# EAGLE board untitled (EAGLE 9.6.2)
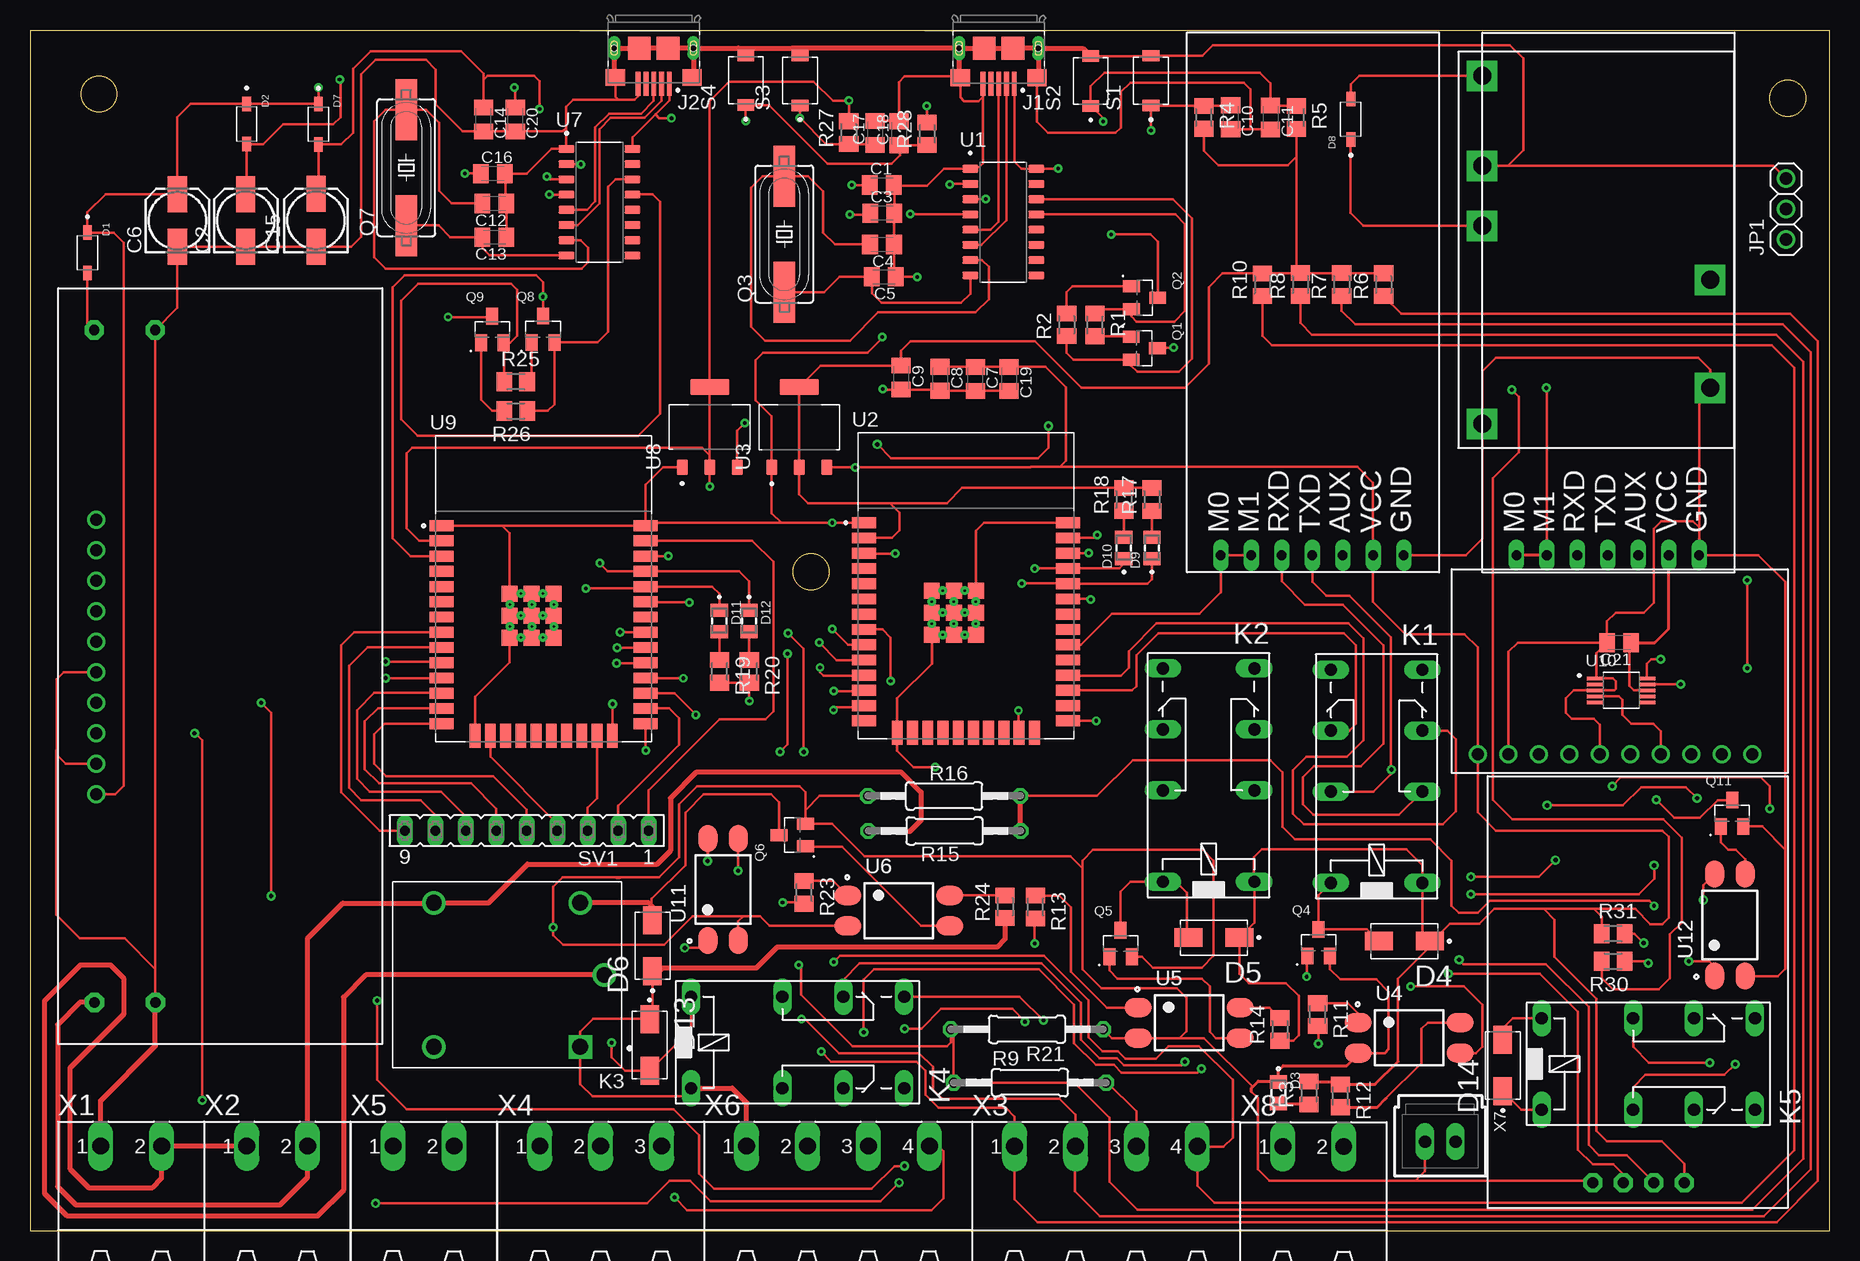
[diagram p1: board, top side]
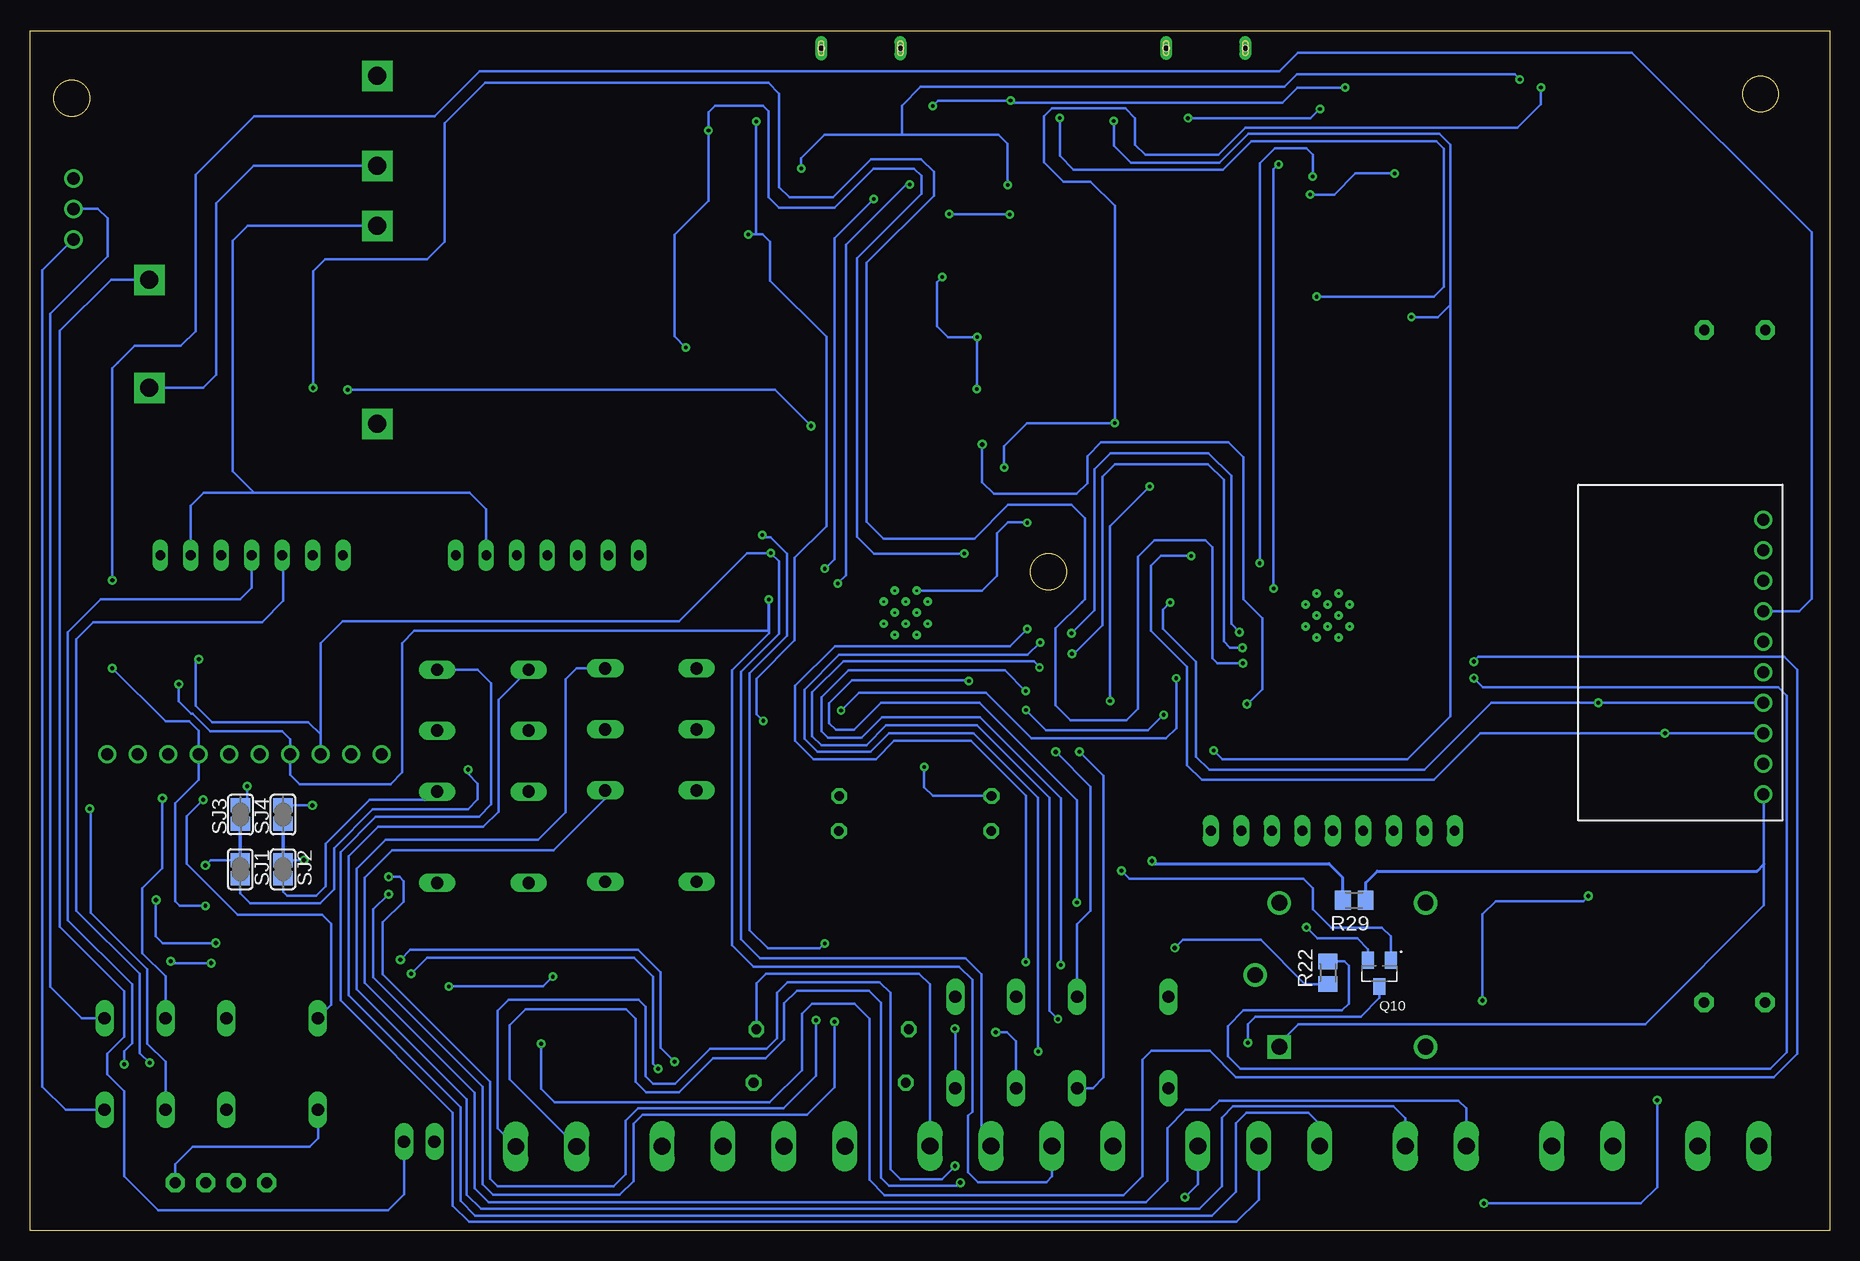
[diagram p2: board, bottom side, seen from below]

Size 150 x 100 mm. Coordinates in mm from the lower left corner, seen from the top.
Outline: 0,0 150,0 150,100 0,100 0,0
Outline: circle at 5.75,94.74 radius 1.5
Outline: circle at 146.5,94.38 radius 1.5
Outline: circle at 65.09,54.92 radius 1.5
Copper layers (1*16): Top 0.035mm / dielectric 1.5mm / Bottom 0.035mm
Design rules "default *": minimum track width 6mil, minimum drill 0.3mm, track to track 6mil, track to pad 6mil, pad to pad 6mil, via to via 6mil, smd to smd 6mil, copper to edge 40mil, drill to drill 40mil, minimum pad ring 10mil, minimum via ring 8mil, stop-mask expansion 4mil, vias tented up to drill 0mil, thermal gap 10mil

## Footprints (pad centres in the part's own frame; a part is rotated, then mirrored left to right if it is on the bottom)
ADS1115 = drill 1: A0 -6.35,-1.27; A1 -6.35,-3.81; A2 -6.35,-6.35; A3 -6.35,-8.89; ADDR -6.35,3.81; ALRT -6.35,1.27; GND -6.35,11.43; SCL -6.35,8.89; SDA -6.35,6.35; VDD -6.35,13.97
C0805K = smd 1.3 x 1.6: 1 -1,0; 2 1,0
153CLV-0505 = smd 3 x 1.6: + 2.2,0; - -2.2,0
SOD3715X145N = smd 1.21 x 0.73: A 1.68,0; C -1.68,0
LEDC2012X120N = smd 1.1 x 1.45: A 0.9,0; C -0.9,0
DIOM5226X240N = smd 2.33 x 1.55: A 2.135,0; C -2.135,0
EBYTEE220-900T22D = drill 0.8 pad 1.27 long: AUX -4.56,-10.98; GND -4.56,-16.06; M0 -4.56,-0.82; M1 -4.56,-3.36; RXD -4.56,-5.9; TXD -4.56,-8.44; VCC -4.56,-13.52
FCI_10118193-0001LF = smd 0.4 x 2: 1 -1.3,2.975; 2 -0.65,2.975; 3 0,2.975; 4 0.65,2.975; 5 1.3,2.975 | smd 1.6 x 1.4: S1 -3.2,2.45; S2 3.2,2.45 | smd 1.9 x 1.9: S3 1.2,0; S4 -1.2,0 | drill 0.5 pad 0.9 long: S5 -3.3,0; S6 3.3,0 | hole 0.5: -3.3,0; 3.3,0
1X03 = drill 1.016: 1 -2.54,0; 2 0,0; 3 2.54,0
351 = drill 1.016 long: 1 -3.81,-3.81; 16 -3.81,3.81; O1 8.89,-3.81; O2 8.89,3.81; P1 3.81,-3.81; P2 3.81,3.81; S1 13.97,-3.81; S2 13.97,3.81
RELAY_SRD-05VDC-SL-C = drill 1.32 square: A1 -6.1,6 | drill 1.32: A2 -6.1,-6; NC 6.1,6; NO 6.1,-6 | drill 1.29: COM -8.1,0
MODUL-BATT = drill 1.5 pad 2.54 square: BATT+ 14,2; BATT- 5,2; IN+ 18.5,21; IN- 2,21; OUT+ 31,21; OUT- 23.5,21
NEO-6MGPS = drill 0.9 pad 1.6 octagon: 5V -8.89,7.62; GND -8.89,15.24; RX -8.89,10.16; TX -8.89,12.7
SOT95P240X120-3N = smd 1 x 1.4: 1 -0.95,-1.1; 2 0.95,-1.1; 3 0,1.1
SM49 = smd 5.08 x 1.778: 1 -4.826,0; 2 4.826,0
M0805 = smd 1.3 x 1.6: 1 -0.95,0; 2 0.95,0
0207/12 = drill 0.813 octagon: 1 -6.35,0; 2 6.35,0
SW_TL1015AF160QG = smd 0.95 x 1.4: 1 -2.075,0; 2 2.075,0
SJ = smd 1.168 x 1.6: 1 -0.762,0; 2 0.762,0
SUPER-STEPDOWN = drill 0.85 pad 1.6 octagon: +5V 59.509,24.006; GND 59.509,18.926; IN+ 3.478,23.979; IN- 3.478,18.899
FE09 = drill 0.813 long: 1 -10.16,0; 2 -7.62,0; 3 -5.08,0; 4 -2.54,0; 5 0,0; 6 2.54,0; 7 5.08,0; 8 7.62,0; 9 10.16,0
SOIC127P600X180-16N = smd 1.31 x 0.62: 1 -2.75,4.445; 2 -2.75,3.175; 3 -2.75,1.905; 4 -2.75,0.635; 5 -2.75,-0.635; 6 -2.75,-1.905; 7 -2.75,-3.175; 8 -2.75,-4.445; 9 2.75,-4.445; 10 2.75,-3.175; 11 2.75,-1.905; 12 2.75,-0.635; 13 2.75,0.635; 14 2.75,1.905; 15 2.75,3.175; 16 2.75,4.445
MODULE_ESP32-WROOM-32D = smd 2 x 0.9: 1 -8.5,5.26; 2 -8.5,3.99; 3 -8.5,2.72; 4 -8.5,1.45; 5 -8.5,0.18; 6 -8.5,-1.09; 7 -8.5,-2.36; 8 -8.5,-3.63; 9 -8.5,-4.9; 10 -8.5,-6.17; 11 -8.5,-7.44; 12 -8.5,-8.71; 13 -8.5,-9.98; 14 -8.5,-11.25; 25 8.5,-11.25; 26 8.5,-9.98; 27 8.5,-8.71; 28 8.5,-7.44; 29 8.5,-6.17; 30 8.5,-4.9; 31 8.5,-3.63; 32 8.5,-2.36; 33 8.5,-1.09; 34 8.5,0.18; 35 8.5,1.45; 36 8.5,2.72; 37 8.5,3.99; 38 8.5,5.26 | smd 0.9 x 2: 15 -5.715,-12.25; 16 -4.445,-12.25; 17 -3.175,-12.25; 18 -1.905,-12.25; 19 -0.635,-12.25; 20 0.635,-12.25; 21 1.905,-12.25; 22 3.175,-12.25; 23 4.445,-12.25; 24 5.715,-12.25 | smd 1.33 x 1.33: 39_1 -2.835,-0.405; 39_2 -1,-0.405; 39_3 0.835,-0.405; 39_4 -2.835,-2.24; 39_5 -1,-2.24; 39_6 0.835,-2.24; 39_7 -2.835,-4.075; 39_8 -1,-4.075; 39_9 0.835,-4.075 | drill 0.2 pad 0.3: 39_10 -1.917,-0.405; 39_11 -0.083,-0.405; 39_12 -2.835,-1.323; 39_13 -1,-1.323; 39_14 0.835,-1.323; 39_15 -1.917,-2.24; 39_16 -0.083,-2.24; 39_17 -2.835,-3.158; 39_18 -1,-3.158; 39_19 0.835,-3.158; 39_20 -1.917,-4.075; 39_21 -0.083,-4.075
SOT229P700X180-4N = smd 1.31 x 0.93: 1 -3.345,2.29; 2 -3.345,0; 3 -3.345,-2.29 | smd 1.31 x 3.24: 4 3.345,0
SOT254P975X400-4N = smd 2.25 x 1.6: 1 -4.25,1.27; 2 -4.25,-1.27; 3 4.25,-1.27; 4 4.25,1.27
SOP50P490X110-10N = smd 1.47 x 0.28: 1 -2.15,1; 2 -2.15,0.5; 3 -2.15,0; 4 -2.15,-0.5; 5 -2.15,-1; 6 2.15,-1; 7 2.15,-0.5; 8 2.15,0; 9 2.15,0.5; 10 2.15,1
MSTBA2 = drill 1.397 long: 1 -2.54,5.08; 2 2.54,5.08
MSTBA4 = drill 1.397 long: 1 -7.62,5.08; 2 -2.54,5.08; 3 2.54,5.08; 4 7.62,5.08
MSTBA3 = drill 1.397 long: 1 -5.08,5.08; 2 0,5.08; 3 5.08,5.08
70543-02 = drill 1.016 long: 1 -1.27,0; 2 1.27,0

## Placement (x,y rotation side)
ADS1  [ADS1115]  134.66,46.07 90 top
ADS2  [ADS1115]  11.86,50.36 180 bottom
C1  1uF  [C0805K]  71.01,87.16 0 top
C2  10uF/16V  [153CLV-0505]  17.98,84.2 90 top
C3  100nF  [C0805K]  71.05,84.81 0 top
C4  22pF  [C0805K]  71.02,82.2 180 top
C5  22pF  [C0805K]  71.17,79.51 180 top
C6  10uF/16V  [153CLV-0505]  12.29,84.19 90 top
C7  1uF  [C0805K]  78.81,71 270 top
C8  1uF  [C0805K]  75.86,71.01 270 top
C9  1uF  [C0805K]  72.62,71.12 270 top
C10  100nF  [C0805K]  100.08,92.81 270 top
C11  100nF  [C0805K]  103.4,92.78 270 top
C12  22pF  [C0805K]  38.71,85.62 180 top
C13  22pF  [C0805K]  38.72,82.81 180 top
C14  1uF  [C0805K]  37.8,92.63 270 top
C15  10uF/16V  [153CLV-0505]  23.84,84.21 90 top
C16  100nF  [C0805K]  38.59,88.1 0 top
C17  100nF  [C0805K]  70.44,91.51 90 top
C18  100nF  [C0805K]  72.45,91.47 90 top
C19  1uF  [C0805K]  81.62,71 270 top
C20  1uF  [C0805K]  40.45,92.63 270 top
C21  100nF  [C0805K]  132.46,49.02 180 top
D1  1N5819HW-7  [SOD3715X145N]  4.79,81.51 270 top
D2  1N5819HW-7  [SOD3715X145N]  18.06,92.24 270 top
D3  SML-LXT0805IW-TR  [LEDC2012X120N]  104.06,11.52 270 top
D4  US1M-13  [DIOM5226X240N]  114.56,24.15 180 top
D5  US1M-13  [DIOM5226X240N]  98.68,24.44 180 top
D6  US1M-13  [DIOM5226X240N]  51.89,23.77 90 top
D7  1N5819HW-7  [SOD3715X145N]  24.04,92.21 270 top
D8  1N5819HW-7  [SOD3715X145N]  110.1,92.65 90 top
D9  SML-LXT0805IW-TR  [LEDC2012X120N]  93.52,56.91 90 top
D10  SML-LXT0805IW-TR  [LEDC2012X120N]  91.18,56.91 90 top
D11  SML-LXT0805IW-TR  [LEDC2012X120N]  57.47,50.83 270 top
D12  SML-LXT0805IW-TR  [LEDC2012X120N]  59.93,50.83 270 top
D13  US1M-13  [DIOM5226X240N]  51.65,15.49 270 top
D14  US1M-13  [DIOM5226X240N]  122.76,13.79 90 top
EBYTEE220-900T22D1  [EBYTEE220-900T22D]  98.45,60.87 90 top
EBYTEE220-900T22D2  [EBYTEE220-900T22D]  123.08,60.86 90 top
J1  10118193-0001LF  [FCI_10118193-0001LF]  80.74,98.55 180 top
J2  10118193-0001LF  [FCI_10118193-0001LF]  52,98.56 180 top
JP1  [1X03]  146.38,85.16 90 top
K1  351  [351]  112.25,32.8 90 top
K2  351  [351]  98.24,32.9 90 top
K3  SRD-05VDC-SL-C  [RELAY_SRD-05VDC-SL-C]  39.77,21.33 180 top
K4  351  [351]  58.9,15.71 0 top
K5  351  [351]  129.82,13.91 0 top
MODUL-BATT1  [MODUL-BATT]  142.05,65.26 90 top
NEO-6MGPS1  [NEO-6MGPS]  145.52,12.89 90 top
Q1  MMBT3904  [SOT95P240X120-3N]  92.89,73.54 270 top
Q2  MMBT3904  [SOT95P240X120-3N]  92.9,77.76 270 top
Q3  12MHz  [SM49]  62.88,83.07 90 top
Q4  S9013  [SOT95P240X120-3N]  107.41,24.01 0 top
Q5  S9013  [SOT95P240X120-3N]  90.91,23.94 0 top
Q6  S9013  [SOT95P240X120-3N]  63.55,32.99 90 top
Q7  12MHz  [SM49]  31.37,88.6 90 top
Q8  MMBT3904  [SOT95P240X120-3N]  42.76,75.14 0 top
Q9  MMBT3904  [SOT95P240X120-3N]  38.54,75.12 0 top
Q10  S9013  [SOT95P240X120-3N]  37.52,21.46 180 bottom
Q11  S9013  [SOT95P240X120-3N]  141.88,34.81 0 top
R1  10k  [M0805]  88.77,75.51 270 top
R2  10k  [M0805]  86.41,75.51 90 top
R3  1k  [M0805]  106.6,11.49 90 top
R4  10k  [M0805]  97.85,92.79 270 top
R5  10k  [M0805]  105.56,92.78 270 top
R6  560  [M0805]  112.83,78.86 90 top
R7  560  [M0805]  109.33,78.86 90 top
R8  560  [M0805]  105.89,78.86 90 top
R9  [0207/12]  83.35,12.35 0 top
R10  560  [M0805]  102.73,78.85 90 top
R11  1k  [M0805]  107.33,18.02 270 top
R12  10k  [M0805]  109.24,11.25 270 top
R13  1k  [M0805]  83.8,26.99 270 top
R14  10k  [M0805]  104.18,16.8 90 top
R15  [0207/12]  76.23,33.33 180 top
R16  [0207/12]  76.2,36.25 0 top
R17  10k  [M0805]  93.53,60.94 90 top
R18  10k  [M0805]  91.2,60.96 90 top
R19  10k  [M0805]  57.49,46.63 270 top
R20  10k  [M0805]  59.96,46.62 270 top
R21  [0207/12]  83.1,16.8 180 top
R22  1k  [M0805]  41.81,21.51 90 bottom
R23  1k  [M0805]  64.53,28.22 270 top
R24  10k  [M0805]  81.28,27.01 90 top
R25  10k  [M0805]  40.49,70.77 0 top
R26  10k  [M0805]  40.5,68.33 180 top
R27  10k  [M0805]  68.25,91.52 90 top
R28  10k  [M0805]  74.78,91.43 90 top
R29  10k  [M0805]  39.61,27.54 180 bottom
R30  1k  [M0805]  131.97,22.47 180 top
R31  10k  [M0805]  131.96,24.76 0 top
S1  TL1015AF160QG  [SW_TL1015AF160QG]  93.43,95.85 90 top
S2  TL1015AF160QG  [SW_TL1015AF160QG]  88.41,95.83 90 top
S3  TL1015AF160QG  [SW_TL1015AF160QG]  64.19,95.86 90 top
S4  TL1015AF160QG  [SW_TL1015AF160QG]  59.66,95.89 90 top
SJ1  [SJ]  132.47,30.13 270 bottom
SJ2  [SJ]  128.91,30.14 270 bottom
SJ3  [SJ]  132.45,34.69 90 bottom
SJ4  [SJ]  128.91,34.69 90 bottom
SUPER-STEPDOWN1  [SUPER-STEPDOWN]  29.36,15.56 90 top
SV1  [FE09]  41.4,33.35 180 top
U1  CH340G  [SOIC127P600X180-16N]  81.13,84.07 0 top
U2  ESP32-WROOM-32D  [MODULE_ESP32-WROOM-32D]  78,53.75 0 top
U3  AMS1117  [SOT229P700X180-4N]  64.12,66.98 90 top
U4  PC817X2NIP0F  [SOT254P975X400-4N]  114.96,16.08 0 top
U5  PC817X2NIP0F  [SOT254P975X400-4N]  96.62,17.34 0 top
U6  PC817X2NIP0F  [SOT254P975X400-4N]  72.42,26.68 0 top
U7  CH340G  [SOIC127P600X180-16N]  47.47,85.73 0 top
U8  AMS1117  [SOT229P700X180-4N]  56.65,66.99 90 top
U9  ESP32-WROOM-32D  [MODULE_ESP32-WROOM-32D]  42.82,53.51 0 top
U10  ADS1115IDGSR  [SOP50P490X110-10N]  132.64,45.04 0 top
U11  PC817X2NIP0F  [SOT254P975X400-4N]  57.77,28.46 90 top
U12  PC817X2NIP0F  [SOT254P975X400-4N]  141.7,25.49 90 top
X1  MSTBA2  [MSTBA2]  8.43,2 0 top
X2  MSTBA2  [MSTBA2]  20.6,2 0 top
X3  MSTBA4  [MSTBA4]  89.69,1.97 0 top
X4  MSTBA3  [MSTBA3]  47.57,1.99 0 top
X5  MSTBA2  [MSTBA2]  32.81,1.99 0 top
X6  MSTBA4  [MSTBA4]  67.35,2 0 top
X7  C-GRID-02-70543  [70543-02]  117.56,7.44 180 top
X8  MSTBA2  [MSTBA2]  106.97,1.95 0 top

## Tracks (layer width: path | path; a pad name or v marks a point on that pad's centre or on a via)
24V+
  Top 0.406: X2.1 X1.2 10.97,4.37 10.21,3.61 4.89,3.61 3.32,5.18 3.32,13.56 7.8,18.04 7.8,21.06 6.7,22.16 4.21,22.16 1.22,19.17 1.22,3.11 3.11,1.22 23.95,1.22 26.13,3.4 26.13,19.48 27.98,21.33 K3.COM
24V++
  Top 0.406: SUPER-STEPDOWN1.IN+ 4.15,19.04 2.3,17.19 2.3,3.69 3.82,2.17 20.84,2.17 23.14,4.47 X2.2 23.14,24.39 26.08,27.32 33.66,27.32 K3.NO 38.23,27.33 38.66,27.77 41.46,30.57 52.28,30.57 53.39,31.68 53.39,36.08 55.52,38.2 72.65,38.2 74.29,36.57 74.29,34.24 73.32,33.27 69.93,33.27 R15.2
A0  (via drill 0.3, 0.35)
  Top 0.203: R16.2 88.96,36.25 91.92,39.21 103.41,39.21 104.41,38.21 104.41,33.69 105.45,32.65 116.71,32.65 118.49,30.87 118.49,27.11 119.1,26.5 120.68,26.5 121.67,27.5 134.98,27.5 v135.38,27.09 | ADS1.A0 135.93,41.64 135.3,42.28 133.48,42.28 132.74,43.02 132.74,44.25 132.46,44.54 U10.4 | v143.14,46.9 143.14,54.2 v143.14,54.2 v143.13,54.21
  Top 0.406: R15.1 82.58,36.22 R16.2
  Bottom 0.203: ADS2.A0 2.51,51.63 1.48,52.66 1.48,83.21 16.46,98.19 44.29,98.19 45.85,96.63 112.51,96.63 116.25,92.89 131.3,92.89 136.19,88.01 136.19,74.99 137.42,73.75 141.28,73.75 142.68,72.36 143.13,71.9 | v143.14,46.9 138.69,42.45 136.74,42.45 135.95,41.66 135.95,39.74 ADS1.A0 135.93,37.6 137.91,35.63 137.91,27.46 137.54,27.09 v135.38,27.09 | 143.14,71.89 143.13,71.9 | v143.13,54.21 143.13,71.9
CONFIG_LORA  (via drill 0.35)
  Top 0.203: R11.2 107.39,17.02 v107.39,15.6 | v29.65,47.44 34.22,47.44 U9.10
  Bottom 0.203: v107.39,15.6 107.39,11.83 106.26,10.71 88.36,10.71 85.66,13.41 85.66,18.11 84.83,18.94 81.29,18.94 80.03,17.68 80.03,4.24 78.77,2.98 58.87,2.98 57.28,4.57 57.28,14.24 56.52,15 51.66,15 49.47,12.81 4.64,12.81 2.68,14.77 2.68,46.76 3.77,47.84 29.25,47.84 v29.65,47.44
CYBLE1  (via drill 0.3)
  Top 0.203: R6.1 114.32,76.42 146.72,76.42 149.02,74.12 149.02,4.16 145.59,0.73 83.98,0.73 82.06,2.64 82.06,7.04 X3.1 82.07,9.53 81.35,10.25 75.74,10.25 74.66,11.34 74.66,13.35 73.89,14.12 66.79,14.12 v65.96,14.94 | v65.8,49.03 65.8,49.02 67.25,47.57 U2.10
  Bottom 0.203: v65.96,14.94 65.96,36.11 71.34,41.49 78.39,41.49 79.95,39.93 84.33,39.93 85.44,41.03 85.44,45.11 82.56,47.99 66.84,47.99 65.81,49.03 v65.8,49.03
CYBLE2  (via drill 0.3)
  Top 0.203: R7.1 109.33,76.69 110.47,75.55 146.12,75.55 148.44,73.23 148.44,5.13 144.53,1.22 89.18,1.22 87.11,3.28 87.11,7.02 X3.2 87.15,9.67 85.82,11.01 76.05,11.01 75.28,11.78 75.28,13.66 74.12,14.81 67.42,14.81 64.59,17.64 v64.31,17.64 | v65.86,46.95 65.86,46.55 66.15,46.26 69.45,46.26 U2.11
  Bottom 0.203: v64.31,17.64 65.01,18.34 65.01,36.1 71.05,42.13 78.64,42.13 80.29,40.48 84.04,40.48 84.79,41.24 84.79,44.87 82.2,47.47 66.31,47.47 65.86,47.02 v65.86,46.95
CYBLE3  (via drill 0.3)
  Top 0.203: R8.1 105.89,75.66 106.87,74.69 145.56,74.69 147.8,72.44 147.8,6 143.57,1.77 92.31,1.77 89.97,4.11 89.97,9.44 87.06,12.35 R9.1 77,16.56 R21.2 76.75,15.71 76.44,15.41 68.55,15.41 64.26,19.69 64.26,21.98 v64.09,22.15 | v67.01,44.98 69.44,44.98 U2.12
  Bottom 0.203: v64.09,22.15 64.06,22.18 64.06,36.04 70.83,42.81 78.97,42.81 80.69,41.09 83.47,41.09 84.01,41.64 84.01,44.47 81.76,46.72 68.75,46.72 v67.01,44.98
CYBLE4  (via drill 0.3)
  Top 0.203: 69.47,50.16 U2.8 71.05,50.12 71.73,49.44 v71.73,45.83 | R23.2 64.43,27.37 v62.73,27.37
  Bottom 0.203: v71.73,45.83 71.78,45.88 81.49,45.88 83.38,43.99 83.38,42.3 82.82,41.74 81.3,41.74 79.04,44 70.83,44 62.73,35.9 v62.73,27.37
CYBLE5  (via drill 0.3)
  Top 0.203: R10.1 102.73,74.6 103.54,73.79 145.18,73.79 147.06,71.91 147.06,6.72 142.69,2.35 98.72,2.35 97.31,3.76 X3.4 97.36,7 99.48,7 100.25,7.78 100.25,12.58 97.45,15.38 94.9,15.38 93.87,14.36 91.32,14.36 90.7,14.98 89.39,14.98 88.22,16.15 88.22,19.24 84.54,22.91 67.51,22.91 v66.99,22.39 | v66.88,50.14 66.91,50.14 68.2,48.85 U2.9
  Bottom 0.203: v66.99,22.39 66.99,36.25 71.58,40.84 77.98,40.84 79.5,39.32 84.69,39.32 86.21,40.84 86.21,45.41 82.9,48.72 68.31,48.72 v66.88,50.14
DTR
  Top 0.203: R1.1 89.13,76.81 Q2.2 91.8,76.2 92.24,75.76 95.38,75.76 96.29,76.67 96.29,83.89 95.48,84.7 U1.13
DTR1
  Top 0.203: R25.1 39.54,73.96 Q9.2 40.02,74.02 40.62,74.62 40.62,78.42 40.1,78.94 32.36,78.94 30.93,77.51 30.93,67.64 32.3,66.28 50.71,66.28 52.51,68.08 52.51,85.78 51.9,86.39 50.25,86.39 U7.13
EN  (via drill 0.3)
  Top 0.203: C10.1 100.02,93.74 R4.1 97.81,93.78 S1.1 v93.44,91.69 | Q1.3 94.06,73.61 v95.33,73.61 | v72.11,56.45 69.53,56.45 U2.3
  Bottom 0.203: v95.33,73.61 96.28,74.56 96.28,82.99 93.44,85.83 v93.44,91.69 93.44,93.24 92.91,93.77 88.9,93.77 88.44,93.31 88.44,86.14 87.58,85.27 82.93,85.27 79.69,88.52 76.3,88.52 75.69,87.92 75.69,86.41 81.06,81.04 81.06,57.86 79.65,56.45 v72.11,56.45
EN1  (via drill 0.3)
  Top 0.203: C17.1 70.38,90.57 R27.1 66.35,90.57 v64.17,92.74 64.17,93.78 S3.1 | U9.3 31.71,56.23 30.23,57.71 30.23,78.65 31.21,79.64 42.18,79.64 42.76,79.06 v42.76,77.85 Q8.3
  Bottom 0.203: v42.76,77.85 32.99,77.85 32.15,78.69 32.15,90.16 32.79,90.81 48.2,90.81 50.57,88.43 63.02,88.43 64.17,89.58 64.17,92.76 v64.17,92.75 v64.17,92.74
GND  (via drill 0.3, 0.35)
  Top 0.203: J2.S2 48.8,94.52 49.06,94.26 | 49.06,94.26 50.41,94.26 50.7,94.56 J2.5 | J1.S2 77.54,94.46 77.85,94.15 79.07,94.15 79.44,94.53 J1.5 79.44,88.99 78.91,88.46 78.44,88.46 U1.1 76.18,88.51 74.76,87.08 72.05,87.08 | C10.2 101.74,91.81 | 101.74,91.81 103.37,91.81 C11.2 | C17.2 72.42,92.5 C18.2 72.45,95.74 72.91,96.2 77.44,96.2 | 72.05,87.08 C3.2 72.02,84.78 C4.1 72.02,79.66 C5.1 v73.94,79.5 | 72.05,87.08 72.05,87.12 C1.2 | U7.1 44.69,90.17 | 44.69,90.17 43.48,90.17 41.41,88.1 39.66,88.1 | 39.66,88.1 C16.2 | 39.66,88.1 39.66,85.68 C12.1 C13.1 | 40.07,53.1 U9.39_10 U9.39_2 41.86,53.1 | 40.07,53.1 U9.39_1 39.98,58.15 39.36,58.77 | 41.86,53.1 U9.39_11 U9.39_3 U9.39_14 U9.39_6 43.57,51.27 | 41.86,53.1 41.82,53.06 U9.39_13 U9.39_5 | 40.07,53.1 39.98,53.02 U9.39_12 U9.39_4 | U9.39_4 U9.39_17 U9.39_7 | U9.39_4 U9.39_15 U9.39_5 | 41.87,51.27 U9.39_16 43.57,51.27 | 41.87,51.27 U9.39_5 | 43.57,51.27 43.57,50.44 U9.39_19 U9.39_9 U9.39_21 U9.39_8 | 41.87,51.27 41.82,51.22 U9.39_18 U9.39_8 | U9.39_7 U9.39_20 U9.39_8 | U2.39_2 U2.39_11 U2.39_3 | U2.39_2 U2.39_10 U2.39_1 U2.39_12 75.17,51.53 | U2.39_3 78.84,58.33 79.52,59.01 85.84,59.01 85.94,58.91 86.4,58.91 U2.38 | U2.39_3 U2.39_14 U2.39_6 78.8,51.51 | U2.39_2 U2.39_13 U2.39_5 | 75.17,51.53 U2.39_4 | 75.23,51.51 U2.39_15 76.92,51.51 | 75.23,51.51 75.19,51.51 75.17,51.53 | 76.92,51.51 U2.39_5 | U2.39_5 U2.39_16 78.8,51.51 | 78.8,51.51 78.8,50.63 U2.39_19 U2.39_9 U2.39_21 U2.39_8 77,49.69 | 76.92,51.51 76.92,50.67 U2.39_18 77,49.69 | 75.23,51.51 75.17,51.45 U2.39_17 U2.39_7 | U2.39_7 U2.39_20 76.1,49.69 77,49.69 | C19.2 C7.2 78.8,70.01 C8.2 75.75,70.12 C9.2 71.12,70.12 v71.09,70.15
  Top 0.203: U2.1 v66.87,59.01 62.63,59.01 | 62.63,59.01 61.83,59.81 U3.1 61.83,67.88 60.5,69.22 60.5,72.56 61.1,73.17 69.8,73.17 71.08,74.45 v71.05,74.49 | U8.1 52.76,63.64 51.3,62.18 51.3,58.8 | 51.3,58.8 U9.38 51.56,59.01 62.63,59.01 | MODUL-BATT1.IN- 121.05,57.66 119.69,56.31 EBYTEE220-900T22D1.GND | MODUL-BATT1.IN- | 64.64,35.06 Q6.2 66.86,33.94 69.58,31.21 86.74,31.21 87.72,30.24 87.72,26.44 | R16.1 65.83,36.25 64.64,35.06 | ADS1.GND 123.23,48.25 124,49.02 C21.2 | U4.2 110.81,14.81 112.94,14.81 113.25,15.12 113.25,19.94 112.22,20.96 109.22,20.96 108.36,21.82 Q4.2 | 39.36,58.77 U9.1 | 39.36,58.77 51.27,58.77 51.3,58.8 | U9.15 37.1,44.49 39.98,47.37 U9.39_7 | 101.74,91.81 101.74,95.15 101.2,95.7 91.72,95.7 90.94,94.91 90.94,91.94 90.49,91.5 84.87,91.5 83.94,92.42 J1.S1 84.04,96.2 | U2.39_7 75.17,47.28 72.29,44.4 U2.15 72.29,40.02 73.66,38.65 v75.46,38.65 | U5.2 95.83,16.07 96.41,16.65 96.41,19.41 95.6,20.21 89.31,20.21 87.72,21.8 87.72,26.44 | 87.72,26.44 87.74,26.43 87.74,30.86 88.62,31.74 97.77,31.74 98.67,30.84 98.67,22.92 97.69,21.95 93.6,21.95 92.7,22.84 Q5.2 | 44.69,91.91 44.69,93.7 45.26,94.26 49.06,94.26 | 44.69,91.91 44.69,90.17 | 44.69,91.91 44.41,91.63 C20.2 C14.2 36.07,91.63 33.81,93.88 33.81,96.77 33.01,97.58 28.8,97.58 27.61,96.38 27.61,82.83 26.79,82.01 C15.- C2.- 12.3,82 C6.- 12.29,76.93 SUPER-STEPDOWN1.GND 10.46,75.04 SUPER-STEPDOWN1.IN- 10.46,21.81 7.89,24.37 4.16,24.37 2.2,26.33 2.2,40.03 2.24,40.07 | MODUL-BATT1.IN- 121.05,71.63 122.17,72.75 139.05,72.75 140.05,71.75 MODUL-BATT1.BATT- 139.14,69.35 139.14,58.63 | 93.76,97.92 97.73,97.92 98.62,98.82 123.37,98.82 124.47,97.72 124.47,90.06 123.17,88.76 MODUL-BATT1.OUT- 145.32,88.76 JP1.3
  Top 0.203: 93.76,97.92 S1.2 | S2.2 93.74,97.91 93.76,97.92 | X7.2 116.29,4.99 115.47,4.17 | 115.47,4.17 103.3,4.17 102.34,5.14 102.34,11.09 101.83,11.59 | 104.03,12.45 D3.C | NEO-6MGPS1.GND 130.11,4.17 115.47,4.17 | 48.87,29.45 49.21,29.45 49.19,29.46 | 101.93,12.02 97.88,16.07 U5.2 | 49.19,29.46 44.39,29.46 43.61,28.68 v43.61,25.29 43.61,24.65 44.43,23.83 52.84,23.83 55.22,26.21 59.46,26.21 | U5.2 90.18,16.07 R21.1 | 74.95,7.1 X6.4 75.67,7.08 76.13,6.62 76.13,2.72 75.15,1.74 54.78,1.74 v53.72,2.8 | ADS2.GND 3,38.93 2.24,39.69 2.24,40.07 | 2.24,40.07 2.24,45.97 2.83,46.57 5.49,46.57 ADS2.ADDR | 64.64,35.06 64.64,36.55 64.14,37.06 55.59,37.06 54.1,35.56 54.1,31.12 52.44,29.46 49.19,29.46 | 59.46,26.21 60.85,26.21 61.65,25.41 U6.2 | U11.2 59.04,25.79 59.46,26.21 | 130.57,46.06 131.95,46.06 132.19,45.81 132.19,45.17 132.06,45.04 U10.3 128.67,45.04 128.04,44.41 128.04,43.19 128.53,42.69 130.34,42.69 130.85,42.18 ADS1.ADDR 130.82,39.69 | 130.57,46.06 130.51,46.06 U10.1 | C21.2 130.57,48.14 130.57,46.06 | C21.2 131.46,50.8 132.18,51.52 134.52,51.52 135.34,52.34 135.34,58.52 135.97,59.16 138.62,59.16 139.14,58.63 | 139.14,58.63 EBYTEE220-900T22D2.GND 139.16,56.32 144.06,56.32 146.3,54.08 146.3,37.53 146.3,31.78 | Q11.2 144.38,33.71 146.3,31.78 | 146.3,31.78 146.31,31.78 146.31,21.87 145.68,21.24 U12.2
  Top 0.254: D3.C 104.06,13.36 104.47,13.77 109.77,13.77 110.81,14.81 | 101.83,11.59 101.83,11.92 101.93,12.02 102.39,12.48 104,12.48 104.03,12.45
  Top 0.406: J1.S6 J1.S3 J1.S4 J1.S5 | J1.S6 77.44,96.2 J1.S2 | J1.S5 84.04,96.2 J1.S1 | J1.S5 87.76,98.55 S2.2 | J2.S2 48.7,96.21 J2.S6 J2.S3 J2.S4 J2.S5 | J2.S5 55.3,96.21 J2.S1 | J2.S5 59.06,98.56 | 59.06,98.56 S4.2 | 59.06,98.56 63.56,98.56 63.57,98.55 | 63.57,98.55 S3.2 | J1.S6 63.57,98.55 | X1.1 5.89,10.85 10.46,15.41 SUPER-STEPDOWN1.IN-
  Bottom 0.203: v73.94,79.5 74.38,79.07 74.38,75.37 73.49,74.49 v71.05,74.49 71.05,70.19 v71.09,70.15 | MODUL-BATT1.BATT- 135.57,70.26 134.5,71.33 134.5,85.65 131.36,88.78 121.07,88.78 MODUL-BATT1.OUT- | R21.1 89.45,20.65 88.65,21.45 75.88,21.45 74.97,20.55 X6.4 | R16.1 74.73,36.25 75.46,36.98 v75.46,38.65 | U2.39_10 70.65,53.35 69.4,54.6 69.4,58.12 68.47,59.05 66.9,59.05 v66.87,59.02 v66.87,59.01 | Q10.2 38.47,23.48 39.37,24.38 42.7,24.38 v43.61,25.29 | v53.72,2.8 52.65,3.87 X4.3
IO0  (via drill 0.3)
  Top 0.203: R5.1 105.51,93.78 C11.1 103.39,93.79 103.39,95.65 102.51,96.52 89.55,96.52 88.41,95.39 S2.1 89.46,92.7 v89.46,92.44 | Q2.3 94,82.44 93.4,83.04 v90.11,83.04 | v88.88,42.51 U2.25
  Bottom 0.203: v90.11,83.04 89.46,83.04 | 89.46,83.04 v89.46,92.44 | v88.88,42.51 89.44,43.07 89.44,46.03 86.26,49.2 86.26,56.1 83.62,58.74 83.62,74.49 88.32,79.19 88.32,82.42 88.94,83.04 89.46,83.04
IO01  (via drill 0.3)
  Top 0.203: C18.1 72.51,90.47 | 72.51,90.47 R28.1 | 72.51,90.47 72.51,89.65 71.81,88.95 66.46,88.95 61.6,93.81 S4.1 v59.65,92.49 | Q9.3 38.47,76.15 v34.85,76.15 | U9.25 v51.33,40.03
  Bottom 0.203: v34.85,76.15 32.63,76.15 31.6,77.18 | 31.6,77.18 31.6,90.51 32.52,91.43 48.43,91.43 50.85,89.01 58.25,89.01 59.65,90.42 v59.65,92.49 | 31.6,77.18 31.6,42.9 35.2,39.29 50.59,39.29 v51.33,40.03
M0
  Top 0.203: EBYTEE220-900T22D1.M1 EBYTEE220-900T22D1.M0 99.27,53.21 97.49,51.43 90.19,51.43 87.62,48.85 U2.30
M1  (via drill 0.35)
  Top 0.203: EBYTEE220-900T22D2.M1 126.44,70.21 v126.41,70.25 | v48.89,47.31 51.29,47.31 U9.29
  Top 0.254: EBYTEE220-900T22D2.M1 EBYTEE220-900T22D2.M0
  Bottom 0.203: v126.41,70.25 126.41,79.95 125.38,80.97 116.89,80.97 115.42,82.45 115.42,92.3 112.05,95.66 88.45,95.66 87.54,94.76 87.54,86.99 86.69,86.14 83.08,86.14 79.91,89.3 75.72,89.3 74.67,88.25 74.67,86.26 80.25,80.67 80.25,59.08 78.85,57.68 71.27,57.68 68.46,60.49 63.2,60.49 62.08,59.37 62.08,52.79 62.08,52.65 62.33,52.4 64.52,50.21 64.52,43.82 63.25,42.55 58.61,42.55 57.64,43.51 57.64,56.19 56.28,57.55 52,57.55 51.44,56.99 51.44,47.73 51.01,47.31 48.92,47.31 48.91,47.32 v48.89,47.31
M2_CONFIGLORA  (via drill 0.35)
  Top 0.203: R30.2 131.02,21.05 131.92,20.14 135.78,20.14 136.69,21.05 136.69,24.7 137.68,25.7 137.68,32.78 136.16,34.3 123.57,34.3 121.95,35.91 121.95,62.74 124.11,64.9 124.11,69.51 v123.53,70.1 | v84.89,67.08 84.89,65.26 84.02,64.39 71.78,64.39 v70.63,65.54 | v48.55,43.91 48.55,41.28 U9.24
  Bottom 0.203: v123.53,70.1 87.91,70.1 v84.89,67.08 | v70.63,65.54 70.63,62.38 69.66,61.41 62.77,61.41 61.87,62.31 61.87,64.57 60.72,65.72 50.08,65.72 48.85,64.49 48.85,52.64 47.26,51.05 47.26,45.14 48.52,43.88 v48.55,43.91
M2_CONFIGRXLORA
  Bottom 0.203: K5.S2 145.7,17.72 148.33,20.35 148.33,76.42 143.54,81.21 143.54,84.37 144.34,85.16 JP1.2
M2_CONFIGTXLORA
  Bottom 0.203: K5.S1 147.04,10.1 148.96,12.03 148.96,80.03 JP1.1
M2_RX  (via drill 0.35)
  Top 0.203: v64.5,39.91 64.5,48.51 v63.2,49.81 | v49.18,49.9 51.3,49.9 U9.31
  Bottom 0.203: K4.P2 62.71,25.55 61.59,26.67 61.59,37 v64.5,39.91 | v63.2,49.81 61.28,51.72 61.28,63.45 59.94,64.8 51.76,64.8 49.87,62.91 49.87,50.59 v49.18,49.9
M2_RXLORA  (via drill 0.35)
  Top 0.203: v138.96,36.04 138.02,36.98 134.31,36.98 132.79,35.46 v126.46,35.46
  Bottom 0.203: K5.O2 138.71,21.21 140.63,23.14 140.63,28.55 138.96,30.22 v138.96,36.04 | v126.46,35.46 SJ4.2
M2_RXLORA1  (via drill 0.35)
  Top 0.203: K5.P2 133.62,15.34 134.95,14.01 v140.03,14.01
  Bottom 0.203: v140.03,14.01 140.84,14.82 140.84,21.41 146.13,26.7 146.13,49.32 144.73,50.72 130.66,50.72 128.88,52.5 128.88,56.2 EBYTEE220-900T22D2.RXD
M2_SWITCHGPS  (via drill 0.35)
  Top 0.203: v29.65,46.07 v29.66,46.07 U9.11
  Bottom 0.203: R22.2 40.42,22.46 40.07,22.11 40.07,18.95 40.65,18.37 48.83,18.37 50.13,17.07 50.13,14.55 49.08,13.51 4.94,13.51 3.58,14.87 3.58,44.62 4.27,45.31 28.89,45.31 v29.65,46.07
M2_TX  (via drill 0.35)
  Top 0.203: v62.53,39.94 63.14,40.55 v63.14,48.1 | v48.93,48.6 U9.30
  Bottom 0.203: K4.P1 61.41,11.9 60.52,12.79 60.52,37.92 v62.53,39.94 | v63.14,48.1 62.96,48.1 60.59,50.47 60.59,62.86 59.56,63.89 51.8,63.89 50.5,62.58 50.5,49.12 49.98,48.6 v48.93,48.6
M2_TXLORA  (via drill 0.35)
  Top 0.203: v145.03,35.19 145.03,37.03 144.27,37.79 132.62,37.79 v131.9,37.06
  Bottom 0.203: v145.03,35.19 144.93,35.1 144.93,26.5 140.24,21.8 140.24,15.61 138.71,14.08 K5.O1 | v131.9,37.06 131.9,36.01 SJ3.2
M2_TXLORA1  (via drill 0.35)
  Top 0.203: K5.P1 133.62,11.96 134.66,12.99 141.25,12.99 v142.15,13.89
  Bottom 0.203: v142.15,13.89 142.15,14.97 141.48,15.63 141.48,20.55 146.83,25.91 146.83,49.88 144.09,52.63 132.5,52.63 131.52,53.6 EBYTEE220-900T22D2.TXD
N$1
  Top 0.203: C4.2 67.09,82.2 66.12,83.17 66.12,86.64 64.86,87.89 Q3.2 61.05,87.89 60.1,86.94 60.1,75.35 61.25,74.2 68.35,74.2 70.69,76.54 78.83,76.54 79.92,77.64 79.92,80.33 79.36,80.89 U1.7
N$2
  Top 0.203: Q3.1 66.2,78.24 67.47,79.51 C5.2 70.17,78.14 70.96,77.35 77.61,77.35 78.38,78.12 U1.8
N$3
  Top 0.203: R1.2 91.73,74.56 Q1.1
N$4
  Top 0.203: R25.2 41.81,71.14 Q8.1
N$5  (via drill 0.3)
  Top 0.203: U1.4 73.39,84.7 v73.36,84.74 | v68.32,84.7 69.94,84.7 C3.1
  Bottom 0.203: v73.36,84.74 68.36,84.74 v68.32,84.7
N$6
  Top 0.203: 104.12,10.56 D3.A
  Top 0.254: R3.1 104.14,10.54 104.12,10.56
N$7
  Top 0.203: SUPER-STEPDOWN1.+5V 4.79,75.63 D1.A
N$8
  Top 0.203: Q2.1 86.89,78.71 86.41,78.24 R2.2
N$9
  Top 0.203: R11.1 109.84,18.97 110.71,18.1 U4.1
N$10
  Top 0.203: U4.4 119.2,17.36 116.52,17.36 115.98,16.82 115.98,13.97 113.04,11.04 112.92,10.92
  Top 0.254: R12.2 112.3,10.3 113.04,11.04
N$11
  Top 0.203: U5.1 89.76,18.61 86.78,21.6 86.78,26.96 85.8,27.94 R13.1
N$12
  Top 0.203: Q4.3 107.41,25.14 | 107.41,25.14 107.41,27.96 K1.16 | D4.A 111.44,25.14 107.41,25.14
N$13  (via drill 0.3)
  Top 0.203: U4.3 120.52,14.81 121.06,15.36 121.06,18.86 119.54,20.38 v115.09,20.38 v115.08,20.37 | v106.42,21.18 106.42,22.87 Q4.1
  Bottom 0.203: v115.08,20.37 107.23,20.37 v106.42,21.18
N$14
  Top 0.203: U5.4 103.32,18.61 R14.2
N$15
  Top 0.203: D5.A 96.42,24.44 96.42,28.2 95.54,29.09 K2.16 91.74,29.09 90.91,28.26 Q5.3
N$16
  Top 0.203: R26.2 38.54,68.33 37.59,69.28 Q9.1
N$17
  Top 0.203: Q5.1 89.97,21.72 90.66,21.02 97.7,21.02 98.36,20.37 98.36,16.58 98.86,16.07 U5.3
N$18
  Top 0.203: D9.A R17.1
N$19
  Top 0.203: R24.2 76.68,27.96 U6.4
N$20
  Top 0.203: D6.A 51.83,25.96 51.83,27.68 54.63,30.48 54.63,34.85 56.15,36.38 61.77,36.38 62.45,35.7 Q6.3
  Top 0.406: D6.A 51.89,27.03 51.58,27.33 K3.A2
N$21
  Top 0.203: D10.A 91.18,60 R18.1
N$22
  Top 0.203: D11.A 57.49,49.91 R19.1
N$23
  Top 0.203: D12.A 59.94,47.6 R20.1
N$24
  Top 0.203: Q6.1 64.68,32.01 67.67,32.01 74.27,25.41 U6.3
N$25
  Top 0.203: U6.1 66.95,29.17 R23.1
N$26  (via drill 0.3)
  Top 0.203: U7.4 43.29,86.36 v43.29,86.36 v43.28,86.36 | v36.24,88.12 37.57,88.12 C16.1
  Bottom 0.203: v43.28,86.36 41.27,86.36 39.52,88.12 v36.24,88.12
N$27
  Top 0.203: Q7.1 34.04,83.79 35.02,82.81 C13.2 37.72,81.89 38.32,81.29 U7.8
N$28
  Top 0.203: C12.2 35.16,85.62 34.09,86.69 34.09,92.34 33,93.43 Q7.2 29.62,93.43 28.68,92.48 28.68,81.13 29.63,80.17 45.97,80.17 46.53,80.73 46.53,81.94 45.91,82.56 U7.7
N$29
  Bottom 0.203: X7.1 118.83,3.05 120.15,1.72 139.3,1.72 142.14,4.57 142.14,11.64 143.54,13.04 143.54,14.77 142.14,16.17 142.14,19.99 147.51,25.35 147.51,75 143.24,79.26 MODUL-BATT1.BATT+
N$30  (via drill 0.35)
  Top 0.203: v54.58,23.58 55.87,23.58 U11.1
  Bottom 0.203: R22.1 43.72,20.56 47.4,24.24 53.91,24.24 v54.58,23.58
N$31  (via drill 0.35)
  Top 0.203: v59.03,30.02 59.04,30.03 U11.3
  Bottom 0.203: Q10.1 36.57,24.56 37.3,25.28 41.52,25.28 43.05,26.81 43.05,28.56 43.84,29.35 58.35,29.35 v59.03,30.02
N$32  (via drill 0.35)
  Top 0.254: v56.48,30.83 56.5,30.85 U11.4
  Bottom 0.254: R29.2 40.56,29.45 41.72,30.61 56.26,30.61 v56.48,30.83
N$33  (via drill 0.35)
  Top 0.203: K4.16 55.09,16.8 D13.A 49.6,13.36 48.47,14.49 v48.47,15.69
  Bottom 0.203: v48.47,15.69 48.47,17.23 47.84,17.86 39.07,17.86 37.52,19.41 Q10.3
N$34  (via drill 0.35)
  Top 0.203: R30.1 134.75,22.47 v134.9,22.32 | v138.28,22.48 139.99,22.48 140.43,22.04 U12.1
  Bottom 0.203: v134.9,22.32 138.12,22.32 v138.28,22.48
N$35
  Top 0.203: Q11.1 140.93,32.38 141.56,31.75 142.2,31.75 142.97,30.98 U12.3
N$36  (via drill 0.35)
  Top 0.203: D14.A 122.76,16.89 123.6,17.73 125.99,17.73 K5.16 | v135.57,35.93 137.07,34.44 139.2,34.44 140.67,35.91 Q11.3
  Bottom 0.203: K5.16 124.88,18.85 124.88,25.59 125.63,26.34 132.7,26.34 136.95,30.59 136.95,34.56 v135.57,35.93
N$38  (via drill 0.35)
  Top 0.203: R31.2 133.73,24.76 v134.51,23.99 | v139.5,27.57 139.5,28.81 U12.4
  Bottom 0.203: v134.51,23.99 138.94,23.99 139.51,24.56 139.51,27.56 v139.5,27.57
OUT1
  Top 0.203: SV1.1 51.56,36.71 57.48,42.62 61.3,42.62 61.97,43.29 61.97,55.75 60.2,57.51 51.33,57.51 U9.37
OUT2
  Top 0.203: SV1.2 49.02,35.44 54.1,40.52 54.1,42.7 53.27,43.54 U9.26
OUT3
  Top 0.203: SV1.3 46.48,35.26 47.27,36.04 U9.23
OUT4
  Top 0.203: U9.16 38.38,39.49 43.95,33.92 SV1.4
OUT5
  Top 0.203: U9.14 34.3,42.28 29.58,42.28 28.67,41.37 28.67,38.93 29.7,37.9 38.6,37.9 41.41,35.1 SV1.5
OUT6
  Top 0.203: U9.13 34.29,43.56 29.02,43.56 27.91,42.46 27.91,38.46 29.09,37.29 36.76,37.29 38.87,35.18 SV1.6
OUT7
  Top 0.203: U9.12 34.28,44.84 28.7,44.84 27.26,43.4 27.26,37.66 28.33,36.6 34.28,36.6 36.33,34.55 SV1.7
OUT8
  Top 0.203: U9.9 34.28,48.65 28.16,48.65 26.59,47.08 26.59,36.93 27.62,35.9 32.57,35.9 33.78,34.68 SV1.8
OUT9
  Top 0.203: U9.8 27.01,49.89 25.95,48.82 25.95,36.54 29.13,33.35 SV1.9
OUT+  (via drill 0.3)
  Top 0.203: MODUL-BATT1.IN+ 111.14,83.76 110.07,84.83 110.07,90.94 D8.C | 23.92,93.92 D2.C 13.39,93.92 12.29,92.81 C6.+ 6.29,86.39 4.79,84.89 D1.C 6.96,83.19 7.8,82.35 7.8,37.1 7.09,36.39 ADS2.VDD | 23.92,93.92 24.02,93.92 D7.C | C8.1 78.8,72.01 C7.1 81.41,72 | 81.41,72 C19.1 | 106.61,12.43 R3.2 | 114.03,14.11 114.03,21 116.7,23.67 116.7,23.93 | 116.7,23.93 D4.C 116.06,24.78 K1.1 116.06,29.16 | R14.1 105.32,15.85 105.76,16.29 105.76,19.58 104.69,20.65 101.6,20.65 100.81,21.43 D5.C | D5.C | K2.1 102.05,28.94 | 102.05,28.94 102.05,25.67 D5.C | 116.7,23.93 118.36,25.59 120.83,25.59 122.07,26.83 126.17,26.83 | 111.94,56.28 111.94,52.44 114.64,49.73 119.57,49.73 120.69,48.62 ADS1.VDD 120.68,39.7 120.68,34.87 122.2,33.35 136.07,33.35 136.59,32.83 136.59,26.08 136.08,25.57 135.08,25.57 133.81,26.83 130.36,26.83 | 111.94,56.28 EBYTEE220-900T22D1.VCC | 116.06,29.16 116.06,30.47 114.72,31.82 102.7,31.82 102.01,31.12 102.01,28.98 102.05,28.94 | 116.16,29.06 116.06,29.16 | U3.3 v68.8,63.63 83.39,63.63 83.42,63.66 85.85,63.66 | 85.85,63.66 86.37,64.18 86.37,70.29 84.63,72.03 81.43,72.03 81.41,72 | U8.3 58.94,66.69 v59.57,67.31 | v24.06,95.3 24.06,94.05 23.92,93.92 | 133.37,49.12 C21.1 133.29,48.86 133.29,45.41 133.67,45.04 U10.8 | 85.85,63.66 110.64,63.66 111.94,62.37 111.94,56.28 | D6.C 51.89,17.86 51.7,17.68 | 51.7,17.68 D13.C | 51.7,17.68 46.96,17.68 45.87,16.59 K3.A1 45.87,12.23 46.9,11.2 54.4,11.2 K4.1 | NEO-6MGPS1.5V 137.9,5.59 136.02,7.47 131.45,7.47 130.58,8.34 130.58,19.34 127.06,22.86 127.06,25.95 126.17,26.83 | 126.17,26.83 130.36,26.83 | K5.1 124.31,10.1 D14.C | R31.1 131.01,26.18 130.36,26.83
  Top 0.254: R3.2 109,12.44 R12.1 112.12,12.2 114.03,14.11 | C21.1 135.43,49.02 136.6,50.2 EBYTEE220-900T22D2.VCC
  Top 0.406: R24.1 81.28,24.31 80.63,23.65 62.27,23.65 60.52,21.91 52.69,21.91 52.42,21.63 D6.C | K4.1 58.53,11.9 59.73,10.69 X6.1
  Bottom 0.203: v68.8,63.63 68.8,63.68 68.82,63.71 68.82,65.39 66.89,67.31 v59.57,67.31 59.57,85.42 61.6,87.45 63.86,87.45 65.46,89.06 65.46,92.87 64.8,93.53 58.68,93.53 57.88,92.73 57.88,90.52 57.03,89.67 50.93,89.67 48.67,91.94 26,91.94 24.06,93.88 v24.06,95.3 | MODUL-BATT1.IN+ 131.87,83.76 133.09,82.53 133.09,63.3 131.32,61.53 | 131.32,61.53 113.34,61.53 111.97,60.15 EBYTEE220-900T22D1.VCC | K3.A1 45.87,15.62 44.27,17.21 15.37,17.21 5.46,27.12 5.46,30.56 5.46,36.35 ADS2.VDD | EBYTEE220-900T22D2.VCC 136.6,60.44 135.51,61.53 131.32,61.53 | NEO-6MGPS1.5V 137.9,5.56 136.44,7.01 126.67,7.01 125.96,7.72 125.96,10.06 K5.1
  Bottom 0.254: R29.1 38.66,29.02 37.7,29.98 6.04,29.98 5.46,30.56
OUT-BATT
  Top 0.203: MODUL-BATT1.OUT+ 110.8,96.26 110.1,95.55 D8.A
PB-PWR
  Top 0.203: X3.3 92.23,9.96 89.83,12.35 R9.2
RTS
  Top 0.203: R2.1 86.41,73.17 86.99,72.59 Q1.2 91.79,72.11 92.3,71.6 95.78,71.6 96.86,72.68 96.86,84.41 95.28,85.98 83.89,85.98 U1.14
RTS1
  Top 0.203: R26.1 43.16,68.33 43.71,68.88 Q8.2 47.3,74.04 48.18,74.92 48.18,87.02 48.8,87.63 U7.14
RX  (via drill 0.3)
  Top 0.203: D10.C 91.18,55.59 90.8,55.2 U2.35 83.76,55.2 v83.73,55.18 | U1.3 v79.67,85.97 v79.68,85.98
  Bottom 0.203: v79.68,85.98 82.93,82.73 82.93,55.98 v83.73,55.18
RX1  (via drill 0.3)
  Top 0.203: D12.C 59.94,54.13 59.08,54.98 51.34,54.98 U9.35 48.17,54.96 v47.48,55.64 | U7.3 43.32,87.63 v43.08,87.87
  Bottom 0.203: v43.08,87.87 43.08,89.7 43.59,90.21 46.25,90.21 47.48,88.98 v47.48,55.64
RX_GPS  (via drill 0.35)
  Top 0.203: K4.O2 67.79,20.95 69.16,22.32 84.33,22.32 87.62,19.03 87.62,15.95 89.16,14.4 90.6,14.4 91.2,13.8 95.97,13.8 v96.26,14.09 | NEO-6MGPS1.RX 135.36,4.06 133.11,6.3 130.79,6.3 129.93,7.17 129.93,18.66 126.35,22.23 119.49,22.23 v119.12,22.6
  Bottom 0.203: v96.26,14.09 | v96.26,14.09 97.45,15.28 97.45,21.55 99.33,23.43 118.3,23.43 v119.12,22.6
RX_LORA
  Top 0.203: K1.P1 114.11,34.66 106.97,34.66 106.08,35.54 106.08,37.8 107.01,38.72 110.93,38.72 112.81,40.6 112.81,48.82 109.43,52.2 106.28,52.2 104.35,54.13 EBYTEE220-900T22D1.RXD
  Bottom 0.203: SJ2.2 128.91,28.26 128.56,27.91 126.16,27.91 125.36,28.71 125.36,32.27 121.71,35.92 116.75,35.92 K1.P1
RX_LORA1  (via drill 0.35)
  Top 0.203: K4.S2 82.5,19.52 v84.47,17.54 | v120.09,29.5 125.76,29.5 v127.16,30.9
  Bottom 0.203: v84.47,17.54 84.47,12.92 87.17,10.22 99.32,10.22 100.35,9.19 100.35,4.7 101.34,3.71 111.01,3.71 111.65,4.36 111.65,12.43 120.59,21.37 120.59,25.7 118.85,27.44 118.85,29.14 119.21,29.5 v120.09,29.5 | v127.16,30.9 128.85,30.9 128.91,30.96
  Bottom 0.305: SJ2.1 128.91,30.96 SJ4.1
RX_MICRO  (via drill 0.3)
  Top 0.203: U9.27 53.72,44.8 v55.51,43.01 | v66.98,43.41 67.21,43.64 69.37,43.64 U2.13
  Bottom 0.203: v55.51,43.01 56.79,41.72 65.3,41.72 v66.98,43.41
RXLORA_CONFIG
  Bottom 0.203: X4.2 47.57,2.6 49.42,0.75 113.41,0.75 114.75,2.09 114.75,9.84 124.12,19.2 124.12,31.57 121.17,34.51 112.57,34.51 111.54,35.54 111.54,45.63 112.68,46.77 K1.S1
RXLORA_MICRO
  Top 0.203: K1.O1 118.14,41.69 118.86,40.98 118.86,34.98 117.76,33.88 106.18,33.88 105.28,34.78 105.28,38.37 106.42,39.51 109.76,39.51 111.15,40.9 111.15,49.38 109.91,50.62 93.91,50.62 91.6,48.32 91.6,46.91 90.95,46.26 86.55,46.26 U2.28
SCL  (via drill 0.3, 0.35)
  Top 0.203: U2.36 86.52,56.49 v88.25,56.49 | v135.92,47.63 135.14,47.63 134.78,47.27 134.78,46.05 U10.10
  Bottom 0.203: v88.25,56.49 90.22,56.49 95.91,50.8 123.93,50.8 125.77,48.96 ADS1.SCL 125.77,41.37 126.8,42.4 134.83,42.4 136.18,43.75 136.18,47.38 v135.92,47.63 | v88.25,56.49 | v88.25,56.49 87.58,55.81 87.58,49.74 90.72,46.6 90.72,24.3 89.16,22.73 72.02,22.73 70.68,21.4 70.68,7.87 X6.3
SCL1  (via drill 0.3, 0.35)
  Top 0.203: v53.22,56.25 53.2,56.23 U9.36 | v72.45,4.03 70.92,2.49 56.71,2.49 55.03,4.17 53.3,4.17 51.42,2.29 v28.8,2.29 | v14.37,10.89 14.37,40.88 13.77,41.48 13.73,41.48 v13.72,41.47
  Bottom 0.203: ADS2.SCL v13.72,41.47 29.09,41.47 32.98,37.58 52.32,37.58 53.56,38.82 53.56,47.02 56.55,50.01 56.55,55.45 55.74,56.25 v53.22,56.25 | X8.1 110.03,12.64 110.03,17.12 108.67,18.48 100.31,18.48 99.52,17.7 99.52,12.41 98.64,11.54 95.91,11.54 93.06,14.39 88.67,14.39 87.14,15.92 87.14,18.96 86.08,20.02 80.08,20.02 79.08,19.02 79.08,4.44 78.39,3.75 72.74,3.75 72.46,4.03 v72.45,4.03 | v28.8,2.29 15.73,2.29 14.37,3.65 v14.37,10.89
SDA  (via drill 0.3, 0.35)
  Top 0.203: U2.33 88.4,52.66 v88.43,52.63 | v137.59,45.55 134.81,45.55 U10.9
  Bottom 0.203: X6.2 64.81,4.55 65.29,4.07 71,4.07 71.82,4.89 71.82,9.58 71.45,9.95 71.45,20.91 72.56,22.02 89.7,22.02 91.49,23.81 91.49,46.72 88.41,49.8 88.41,52.56 88.43,52.58 v88.43,52.63 88.43,50.13 88.56,50.01 117.96,50.01 118.98,48.98 118.98,38.2 119.96,37.23 127.51,37.23 128.31,38.02 ADS1.SDA 128.31,40.98 128.97,41.65 134.98,41.65 136.44,43.12 136.55,43.12 137.59,44.16 v137.59,45.55
SDA1  (via drill 0.3, 0.35)
  Top 0.203: v54.96,52.37 51.37,52.37 U9.33 | v72.9,5.41 72.04,5.41 70.16,3.53 57.04,3.53 55.78,4.78 55.78,7.99 53.63,10.14 31.4,10.14 28.93,12.61 v28.93,19.19 | v20.12,27.91 20.12,43.18 v19.28,44.02 v19.28,44.01
  Bottom 0.203: ADS2.SDA v19.28,44.01 28.19,44.01 33.76,38.43 51.7,38.43 52.8,39.53 52.8,47.41 55.57,50.19 55.57,51.76 v54.96,52.37 | X8.2 111.03,8.55 111.03,18.34 110.11,19.25 99.25,19.25 98.69,18.7 98.69,12.9 98.07,12.27 96.24,12.27 93.32,15.19 88.62,15.19 87.75,16.06 87.75,19.84 86.85,20.74 79.2,20.74 78.29,19.83 78.29,5.15 77.45,4.31 73.99,4.31 v72.9,5.41 | v28.93,19.19 28.93,26.38 27.82,27.49 20.54,27.49 v20.12,27.91
TX  (via drill 0.3)
  Top 0.203: D9.C 93.52,54.31 93.14,53.93 U2.34 86.48,53.95 v82.67,53.95 | U1.2 76.72,87.24 v76.68,87.19
  Bottom 0.203: v76.68,87.19 76.98,87.19 82,82.17 82,54.62 v82.67,53.95
TX1  (via drill 0.3)
  Top 0.203: D11.C 57.47,53.1 56.87,53.7 U9.34 51.17,53.54 v46.34,53.54 | U7.2 45.91,88.9 v45.92,88.89
  Bottom 0.203: v46.34,53.54 46.34,88.47 v45.92,88.89
TX_GPS  (via drill 0.35)
  Top 0.203: v69.5,16.55 69.5,20.93 70.36,21.79 84.09,21.79 87.03,18.86 87.03,15.65 88.86,13.83 90.35,13.83 90.99,13.19 97.31,13.19 v97.64,13.52 | NEO-6MGPS1.TX 132.82,4.72 132,5.54 130.26,5.54 129.02,6.78 129.02,18.25 125.84,21.43 v118.23,21.43
  Bottom 0.203: K4.O1 67.79,15.79 68.56,16.55 v69.5,16.55 | v97.64,13.52 v97.65,13.52 98.05,13.92 98.05,21.19 99.64,22.77 116.89,22.77 v118.23,21.43
TX_LORA  (via drill 0.35)
  Top 0.203: K1.P2 111.99,36.61 113.48,38.11 v113.48,38.45 113.44,38.49 113.44,49.46 109.98,52.92 108.07,52.92 106.89,54.11 EBYTEE220-900T22D1.TXD
  Bottom 0.203: SJ1.2 132.47,28.13 131.64,27.3 125.83,27.3 124.67,28.45 124.67,31.89 121.42,35.13 113.5,35.13 112.67,35.96 112.67,37.27 113.48,38.09 v113.48,38.45
TX_LORA1  (via drill 0.35)
  Top 0.203: v72.91,16.84 74.3,16.84 75.96,18.5 81.89,18.5 v82.95,17.44 | v120.11,28.05 134.09,28.05 135.38,29.34 v135.38,30.45
  Bottom 0.203: K4.S1 72.87,16.81 v72.91,16.84 | v82.95,17.44 82.95,11.99 85.25,9.68 98.93,9.68 99.7,8.91 99.7,4.13 100.84,3 111.4,3 112.27,3.87 112.27,12.01 121.38,21.12 121.38,26.78 v120.11,28.05 | v135.38,30.45 134.94,30.9 SJ1.1
  Bottom 0.305: SJ1.1 132.47,33.91 SJ3.1
TX_MICRO  (via drill 0.3)
  Top 0.203: U9.28 54.43,46.07 v54.45,46.05 | U2.23 82.4,41.55 v82.4,43.36
  Bottom 0.203: v54.45,46.05 54.45,41.89 55.3,41.04 66.51,41.04 70.31,44.84 80.91,44.84 v82.4,43.36
TXLORA_CONFIG
  Bottom 0.203: K1.S2 110.95,44.26 110.95,34.95 112.22,33.68 120.98,33.68 123.44,31.23 123.44,19.63 114.12,10.31 114.12,2.5 112.89,1.26 51.47,1.26 49.48,3.25 49.48,8.97 48.61,9.84 43.45,9.84 42.49,8.88 X4.1
TXLORA_MICRO
  Top 0.203: K1.O2 109.97,41.69 110.53,42.25 110.53,48.81 109.51,49.82 94.08,49.82 92.21,47.95 92.21,45.37 91.87,45.03 86.51,45.03 U2.27
USB1_N
  Top 0.203: J2.2 52.65,94.18 51.21,92.75 48.41,92.75 47.48,91.81 47.48,85.65 45.65,83.82 U7.6
USB1_P
  Top 0.203: J2.3 52,94.18 50.92,93.1 48.27,93.1 47.12,91.96 47.12,85.8 46.42,85.1 U7.5
USB_N
  Top 0.203: J1.2 81.39,84.23 79.32,82.16 U1.6
USB_P
  Top 0.203: J1.3 80.74,84.09 80.08,83.43 U1.5
VALVE  (via drill 0.3)
  Top 0.203: U2.37 88.69,57.74 v88.96,58.01 | v83.74,23.96 83.74,25.98 R13.2
  Bottom 0.203: v88.96,58.01 88.76,57.81 88.28,57.81 86.89,56.41 86.89,49.61 90.02,46.48 90.02,25.07 88.49,23.55 84.17,23.55 83.75,23.97 v83.74,23.96
VALVE1
  Bottom 0.203: K2.S1 104.43,46.87 105.34,45.96 105.34,34.88 107.63,32.59 120.34,32.59 122.77,30.17 122.77,20.14 113.59,10.96 113.59,3.03 112.4,1.84 52.53,1.84 50.66,3.7 50.66,9.42 49.72,10.37 36.35,10.37 35.35,9.37 X5.2
VALVE2
  Bottom 0.203: K2.P1 102.05,36.03 106.34,31.74 119.81,31.74 122.12,29.42 122.12,20.66 112.95,11.49 112.95,3.55 111.79,2.38 57,2.38 55.2,4.18 55.2,8.56 53.68,10.08 51.63,10.08 50.85,10.86 30.92,10.86 30.27,10.21 X5.1
VCC
  Top 0.203: R4.2 97.85,90.02 99.06,88.81 104.84,88.81 105.56,89.52 | 105.56,89.52 R5.2 | 69.49,57.76 U2.2 71.83,57.74 72.49,58.4 72.49,59.84 71.67,60.65 71.54,60.65 | R17.2 93.5,61.91 R18.2 77.7,61.91 76.42,60.64 71.55,60.64 71.54,60.65 | 71.54,60.65 64.86,60.65 64.12,61.4 U3.2 U3.4 65.92,72.12 C9.1 72.62,73.35 73.41,74.15 83.77,74.15 87.64,70.28 96.26,70.28 98.26,72.27 98.26,78.66 99.4,79.8 R10.2 102.74,79.81 R8.2 | 105.56,89.52 105.56,80.15 R8.2 | R7.2 | R6.2 R7.2 | R7.2 R8.2
VCC1  (via drill 0.3)
  Top 0.203: U8.2 56.65,63.79 | 56.65,63.79 56.65,64.64 | 56.65,64.64 U8.4 56.65,94.15 58.27,95.78 65.33,95.78 66.92,94.19 v68.27,94.19 68.27,92.48 R27.2 | R19.2 R20.2 59.96,44.18 v59.98,44.16 | U9.2 32.44,57.5 31.39,58.55 31.39,64.78 31.86,65.26 56.04,65.26 56.65,64.64 | v40.39,95.28 40.45,95.22 C20.1 | v74.75,93.73 74.78,93.7 R28.2 | v56.66,62.04 56.66,63.79 56.65,63.79
  Bottom 0.203: v40.39,95.28 44.34,95.28 45.61,94.01 68.09,94.01 v68.27,94.19 74.3,94.19 v74.75,93.73 | v59.98,44.16 59.98,58.71 v56.66,62.04
VUSB  (via drill 0.3)
  Top 0.203: J1.1 82.04,89.11 82.64,88.51 U1.16 85.71,88.51 v85.72,88.52 | C2.+ 18.06,86.48 D2.A 19.45,90.56 21.11,92.21 25.28,92.21 25.88,92.81 25.88,95.89 v25.82,95.95 | C1.1 68.53,87.16 v68.52,87.17
  Bottom 0.203: v85.72,88.52 85.72,89.39 83.78,91.33 77.32,91.33 | 77.32,91.33 77.32,93.76 75.76,95.33 45.45,95.33 44.4,96.38 26.25,96.38 v25.82,95.95 | v68.52,87.17 68.52,90.61 69.25,91.35 77.3,91.35 77.32,91.33
VUSB1  (via drill 0.3)
  Top 0.203: J2.1 53.3,94.2 52.13,93.03 | U7.16 50.22,91.12 52.13,93.03 | C15.+ 24.04,86.61 D7.A 25.95,90.53 26.92,91.51 26.92,96.83 28.4,98.31 35.92,98.31 37.8,96.42 37.8,95.95 | 37.8,95.95 C14.1 | v53.48,92.72 52.44,92.72 52.13,93.03 | v42.48,93.51 42.48,95.8 42.01,96.27 38.13,96.27 37.8,95.95
  Bottom 0.203: v42.48,93.51 43.26,92.72 v53.48,92.72 53.5,92.74